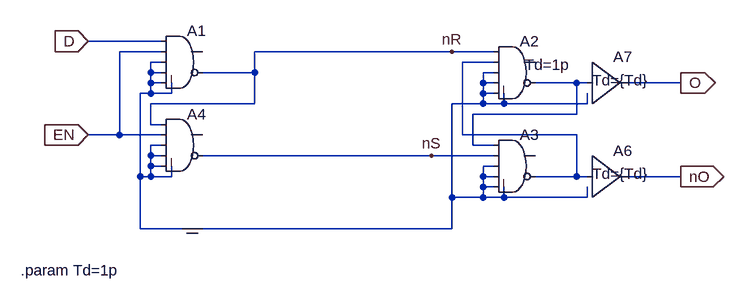
[diagram p0: schematic D-latch.asc]
D-latch.asc, the LTspice schematic file:
Version 4
SHEET 1 880 680
WIRE -192 48 -304 48
WIRE -192 64 -256 64
WIRE 256 64 -48 64
WIRE 320 64 256 64
WIRE -192 80 -208 80
WIRE 320 80 272 80
WIRE -208 96 -208 80
WIRE -192 96 -208 96
WIRE -48 96 -48 64
WIRE -48 96 -128 96
WIRE 320 96 304 96
WIRE -208 112 -208 96
WIRE -192 112 -208 112
WIRE 304 112 304 96
WIRE 320 112 304 112
WIRE 448 112 384 112
WIRE 464 112 448 112
WIRE 608 112 528 112
WIRE -208 128 -208 112
WIRE -208 128 -224 128
WIRE -176 128 -176 112
WIRE -176 128 -208 128
WIRE 304 128 304 112
WIRE 320 128 304 128
WIRE -48 144 -48 96
WIRE -48 144 -208 144
WIRE 304 144 304 128
WIRE 304 144 256 144
WIRE 336 144 336 128
WIRE 336 144 304 144
WIRE 464 144 464 128
WIRE 464 144 336 144
WIRE 448 160 448 112
WIRE 448 160 288 160
WIRE -208 176 -208 144
WIRE -192 176 -208 176
WIRE -256 192 -256 64
WIRE -256 192 -304 192
WIRE -192 192 -256 192
WIRE 272 192 272 80
WIRE 448 192 272 192
WIRE -192 208 -208 208
WIRE 288 208 288 160
WIRE 320 208 288 208
WIRE -208 224 -208 208
WIRE -192 224 -208 224
WIRE 224 224 -128 224
WIRE 320 224 224 224
WIRE -208 240 -208 224
WIRE -192 240 -208 240
WIRE 320 240 304 240
WIRE -224 256 -224 128
WIRE -208 256 -208 240
WIRE -208 256 -224 256
WIRE -176 256 -176 240
WIRE -176 256 -208 256
WIRE 304 256 304 240
WIRE 320 256 304 256
WIRE 448 256 448 192
WIRE 448 256 384 256
WIRE 464 256 448 256
WIRE 608 256 528 256
WIRE 304 272 304 256
WIRE 320 272 304 272
WIRE 256 288 256 144
WIRE 304 288 304 272
WIRE 304 288 256 288
WIRE 336 288 336 272
WIRE 336 288 304 288
WIRE 464 288 464 272
WIRE 464 288 336 288
WIRE -224 336 -224 256
WIRE -144 336 -224 336
WIRE 256 336 256 288
WIRE 256 336 -144 336
FLAG -304 192 EN
IOPIN -304 192 In
FLAG -304 48 D
IOPIN -304 48 In
FLAG 608 112 O
IOPIN 608 112 Out
FLAG 608 256 nO
IOPIN 608 256 Out
FLAG -144 336 COM
IOPIN -144 336 BiDir
FLAG 256 64 nR
FLAG 224 224 nS
SYMBOL Digital\\and -160 16 R0
SYMATTR InstName A1
SYMBOL Digital\\and 352 32 R0
WINDOW 3 16 52 Left 2
SYMATTR Value Td=1p
SYMATTR InstName A2
SYMBOL Digital\\and 352 176 R0
SYMATTR InstName A3
SYMBOL Digital\\and -160 144 R0
SYMATTR InstName A4
SYMBOL Digital\\buf1 464 192 R0
WINDOW 3 8 60 Left 2
SYMATTR InstName A6
SYMATTR Value Td={Td}
SYMBOL Digital\\buf1 464 48 R0
WINDOW 3 8 60 Left 2
SYMATTR InstName A7
SYMATTR Value Td={Td}
TEXT -408 400 Left 2 !.param Td=1p

The netlist it stands for:
* D-latch.asc
A1 D EN COM COM COM nR COM COM AND
A2 nR N001 COM COM COM N002 COM COM AND Td=1p
A3 N002 nS COM COM COM N001 COM COM AND
A4 nR EN COM COM COM nS COM COM AND
A6 N001 COM COM COM COM COM nO COM BUF Td={Td}
A7 N002 COM COM COM COM COM O COM BUF Td={Td}
.param Td=1p
.backanno
.end